# Altium schematic sheet ILI9341_4Wire.SchDoc: LCD(ER-TFT032-3.1)
size 209 x 148 mm; DocumentNumber: 5; SheetNumber: 5; SheetTotal: 10
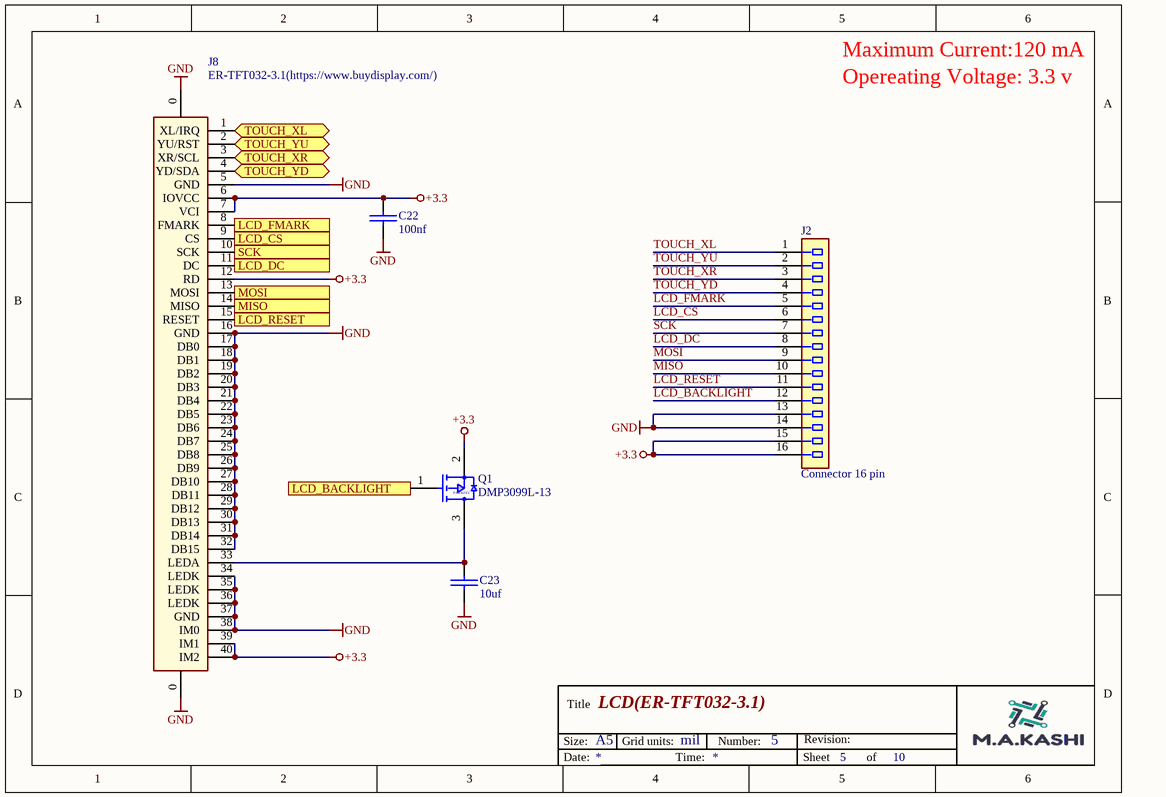
[diagram p0: ILI9341_4Wire.SchDoc]

## Parts
C22  100nf  [CAP_0402_IPC_A]
C23  10uf  [CAP_0805_IPC_A]
J2  Connector 16 pin  [DS1013-16S]
J8  ER-TFT032-3.1(https://www.buydisplay.com/)  [FPC 40]
Q1  DMP3099L-13  [Diodes_Inc_SOT23_IPC_A]

## Ports
LCD_BACKLIGHT (in), LCD_CS (in), LCD_DC (in), LCD_FMARK (out), LCD_RESET (in), MISO (out), MOSI (in), SCK (in), TOUCH_XL (bidir), TOUCH_XR (bidir), TOUCH_YD (bidir), TOUCH_YU (bidir)

## Nets
+3.3: C22.2 J2.15 J2.16 J8.6(IOVCC) J8.7(VCI) J8.12(RD) J8.39(IM1) J8.40(IM2) Q1.2(S)
GND: C22.1 C23.2 J2.13 J2.14 J8.0 J8.5(GND) J8.16(GND) J8.17(DB0) J8.18(DB1) J8.19(DB2) J8.20(DB3) J8.21(DB4) J8.22(DB5) J8.23(DB6) J8.24(DB7) J8.25(DB8) J8.26(DB9) J8.27(DB10) J8.28(DB11) J8.29(DB12) J8.30(DB13) J8.31(DB14) J8.32(DB15) J8.34(LEDK) J8.35(LEDK) J8.36(LEDK) J8.37(GND) J8.38(IM0)
LCD_BACKLIGHT: Q1.1(G) ; port LCD_BACKLIGHT
LCD_BACKLIGHT: J2.12  [a separate net that carries the same name]
LCD_CS: J8.9(CS) ; port LCD_CS
LCD_CS: J2.6  [a separate net that carries the same name]
LCD_DC: J8.11(DC) ; port LCD_DC
LCD_DC: J2.8  [a separate net that carries the same name]
LCD_FMARK: J8.8(FMARK) ; port LCD_FMARK
LCD_FMARK: J2.5  [a separate net that carries the same name]
LCD_RESET: J8.15(RESET) ; port LCD_RESET
LCD_RESET: J2.11  [a separate net that carries the same name]
MISO: J8.14(MISO) ; port MISO
MISO: J2.10  [a separate net that carries the same name]
MOSI: J8.13(MOSI) ; port MOSI
MOSI: J2.9  [a separate net that carries the same name]
SCK: J8.10(SCK) ; port SCK
SCK: J2.7  [a separate net that carries the same name]
TOUCH_XL: J8.1(XL/IRQ) ; port TOUCH_XL
TOUCH_XL: J2.1  [a separate net that carries the same name]
TOUCH_XR: J8.3(XR/SCL) ; port TOUCH_XR
TOUCH_XR: J2.3  [a separate net that carries the same name]
TOUCH_YD: J8.4(YD/SDA) ; port TOUCH_YD
TOUCH_YD: J2.4  [a separate net that carries the same name]
TOUCH_YU: J8.2(YU/RST) ; port TOUCH_YU
TOUCH_YU: J2.2  [a separate net that carries the same name]
NetC23_1: C23.1 J8.33(LEDA) Q1.3(D)

## Notes on the sheet
- Maximum Current:120 mA
- Opereating Voltage: 3.3 v
- Size:
- Title
- A5
- Grid units:
- mil
- Number:
- Revision:
- Date:
- Time:
- Sheet
- of
- (in symbol DMP3099L-13_1) P-MOSFET

## Library data of the parts
C22 = Capacitor: octopart or digikey description!; Part Number: C0402X7R160-104KNE; Capacitance: 100nf; Voltage Rating: *
C23 = Capacitor: octopart or digikey description!; Part Number: CL21A106KOQNNNG; Voltage Rating: 16v; Capacitance: 10uf
J8 = LCD_ILI9341: 50pin FPC connector, 0.5mm pitch, Top/Bottom contacts; Part Number: ER-TFT032-3.1(https://www.buydisplay.com/)
Q1 = DMP3099L-13_1: Part Number: DMP3099L-13